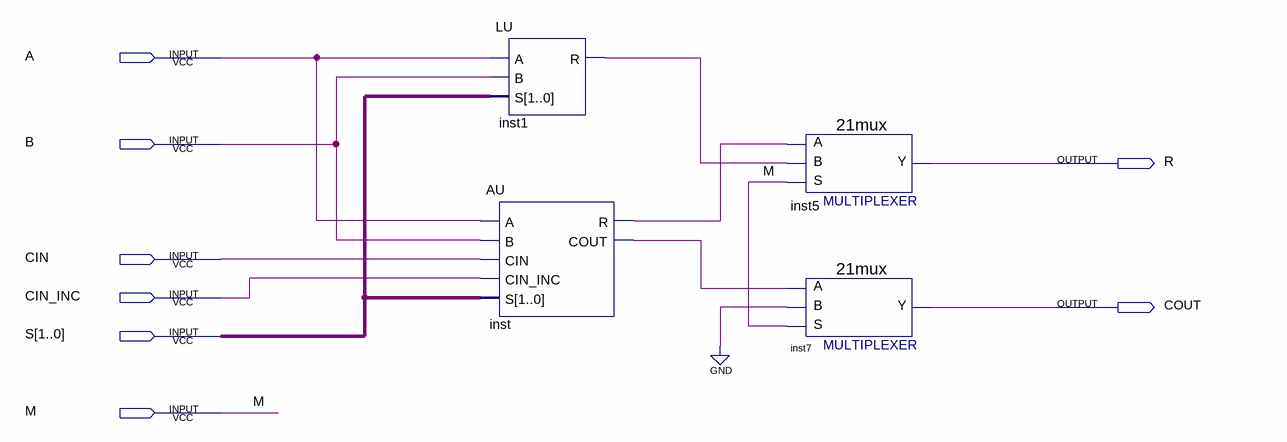
[diagram p0: schematic sheet]
// Quartus schematic ALU.bdf as structural Verilog: 4 symbols, 8 pins
module ALU (
  input  A,
  input  B,
  input  CIN,
  input  CIN_INC,
  input  [1:0] S,
  input  M,
  output R,
  output COUT
);

  wire inst1_r, inst_cout, inst_r;

  LU inst1 (.A(A), .B(B), .S(S), .R(inst1_r));
  AU inst (.A(A), .B(B), .CIN(CIN), .CIN_INC(CIN_INC), .S(S), .R(inst_r), .COUT(inst_cout));
  \21mux  inst5 (.S(M), .B(inst1_r), .A(inst_r), .Y(R));
  \21mux  inst7 (.S(M), .B(1'b0), .A(inst_cout), .Y(COUT));
endmodule
